# EAGLE design lf (EAGLE 7.7.0)
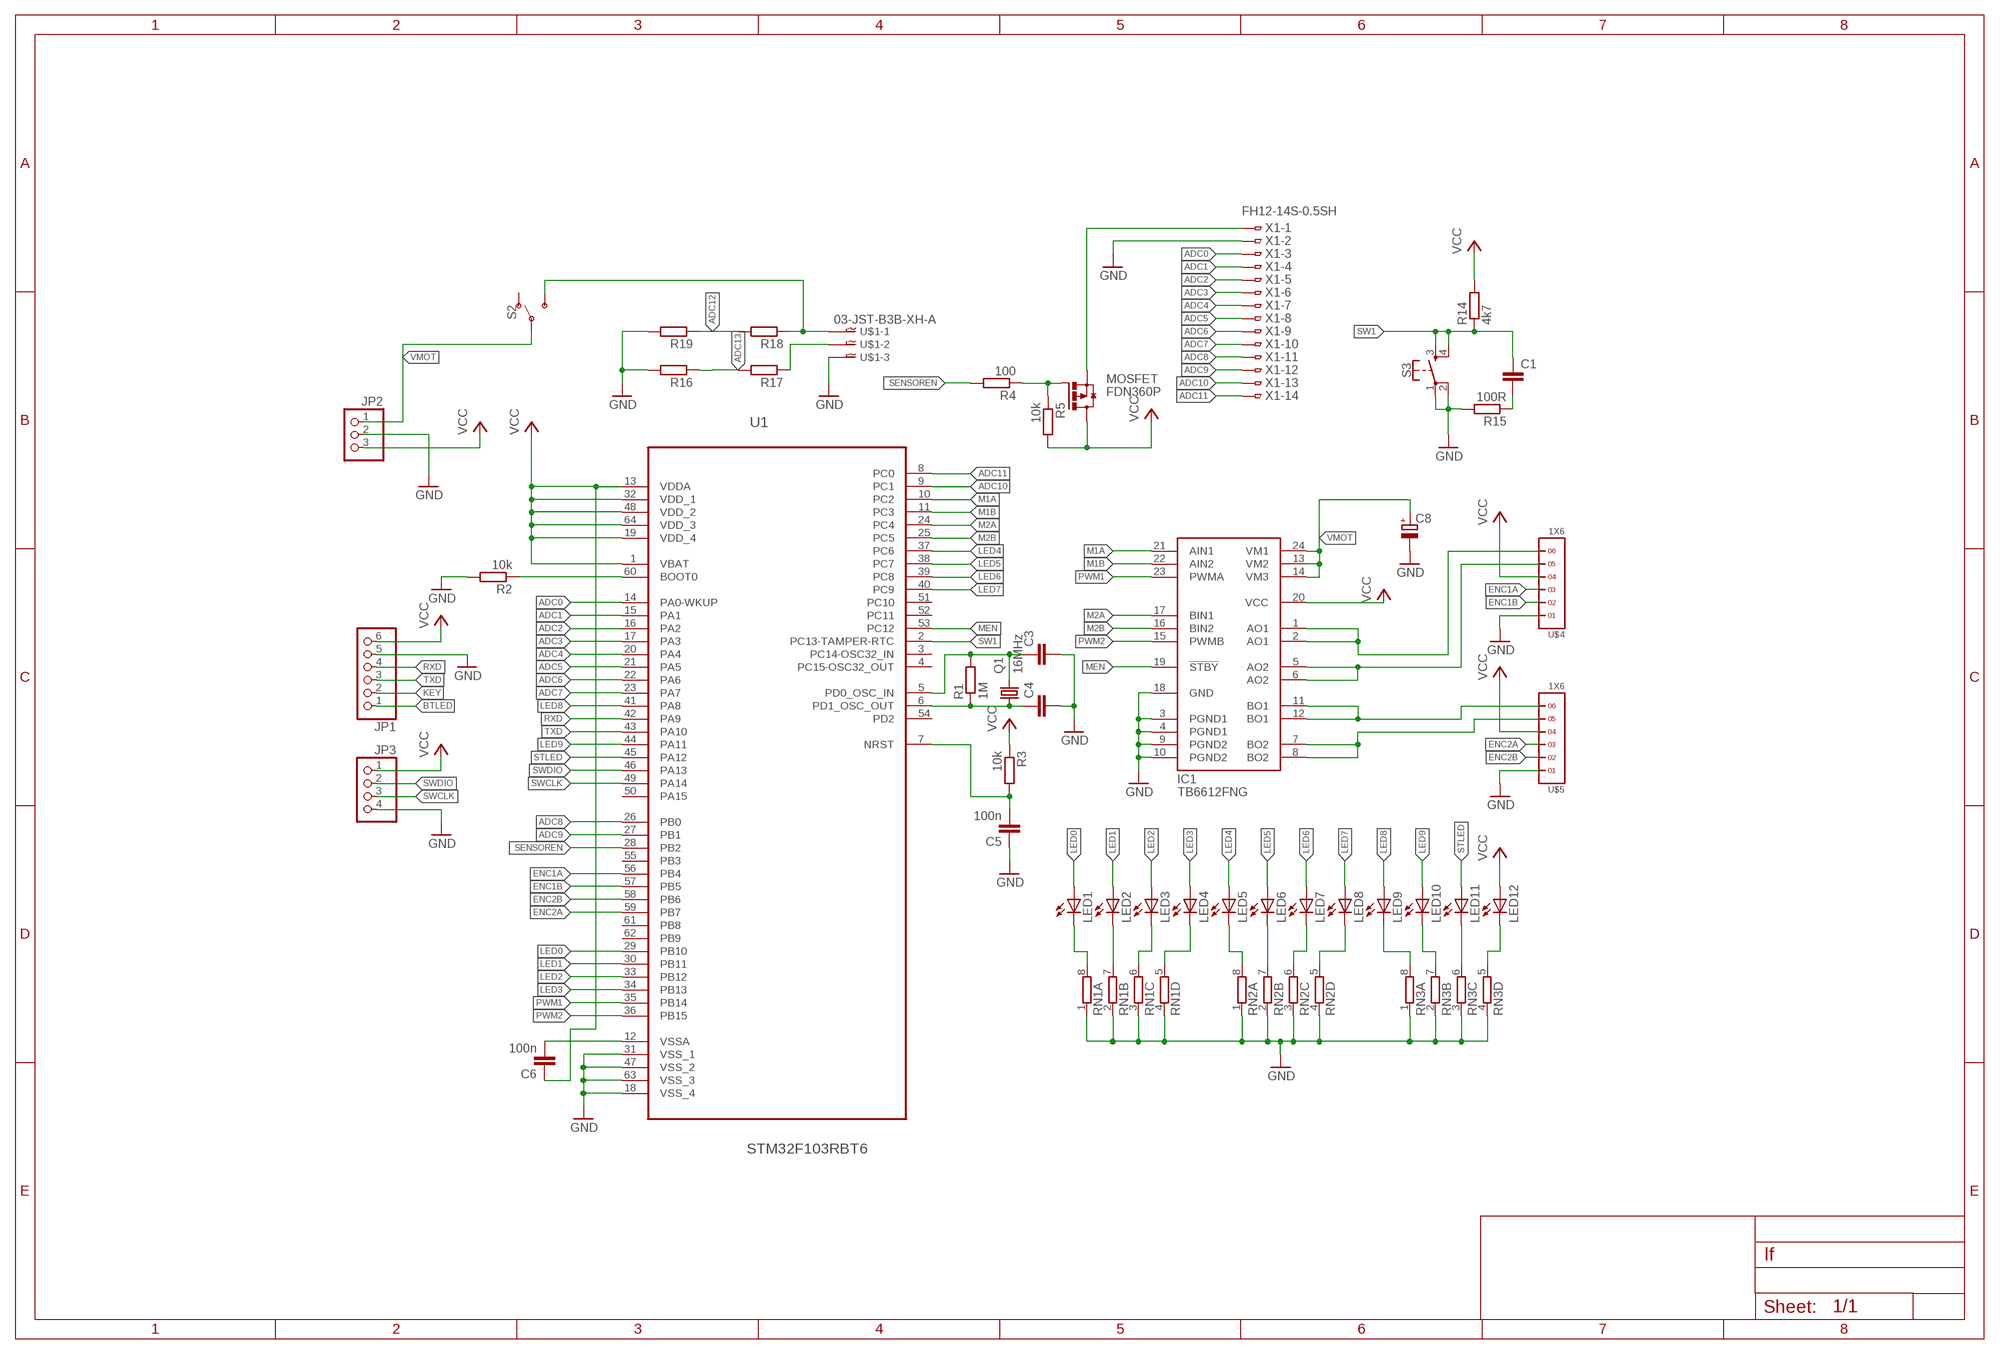
[diagram p0: schematic, sheet 1]

## Parts
C1  C-EUC0603K  [C0603K]
C3  C-EUC0603K  [C0603K]
C4  C-EUC0603K  [C0603K]
C5  100n  C-EUC0603K  [C0603K]
C6  100n  C-EUC0603K  [C0603K]
C8  CPOL-EUC/6032-28R  [C/6032-28R]
IC1  TB6612FNG  [SSOP24]
JP1  PINHD-1X6  [1X06]
JP2  PINHD-1X3  [1X03]
JP3  PINHD-1X4  [1X04]
LED1  LEDCHIPLED_0603  [CHIPLED_0603]
LED2  LEDCHIPLED_0603  [CHIPLED_0603]
LED3  LEDCHIPLED_0603  [CHIPLED_0603]
LED4  LEDCHIPLED_0603  [CHIPLED_0603]
LED5  LEDCHIPLED_0603  [CHIPLED_0603]
LED6  LEDCHIPLED_0603  [CHIPLED_0603]
LED7  LEDCHIPLED_0603  [CHIPLED_0603]
LED8  LEDCHIPLED_0603  [CHIPLED_0603]
LED9  LEDCHIPLED_0603  [CHIPLED_0603]
LED10  LEDCHIPLED_0603  [CHIPLED_0603]
LED11  LEDCHIPLED_0603  [CHIPLED_0603]
LED12  LEDCHIPLED_0603  [CHIPLED_0603]
MOSFET  FDN360P  [SUPER-SOT3]
Q1  16MHz  KX-7  [3.2X2.5_KX-7]
R1  1M  R-EU_R0603  [R0603]
R2  10k  R-EU_R0603  [R0603]
R3  10k  R-EU_R0603  [R0603]
R4  100  R-EU_R0603  [R0603]
R5  10k  R-EU_R0603  [R0603]
R14  4k7  R-EU_R0603  [R0603]
R15  100R  R-EU_R0603  [R0603]
R16  R-EU_R0603  [R0603]
R17  R-EU_R0603  [R0603]
R18  R-EU_R0603  [R0603]
R19  R-EU_R0603  [R0603]
RN1  4R-NEXB28V  [EXB28V]
RN2  4R-NEXB28V  [EXB28V]
RN3  4R-NEXB28V  [EXB28V]
S2  SWITCH-SPDT-PTH-11.6X4.0MM  [SWITCH_SPDT_PTH_11.6X4.0MM]
S3  MOMENTARY-SWITCH-SPST-2-SMD-5.2MM  [TACTILE_SWITCH_SMD_5.2MM]
U1  STM32F103RBT6  [QFP50P1200X1200X160-64N]
U$1  03-JST-B3B-XH-A  [B3B-XH]
U$4  1X6  [1X6]
U$5  1X6  [1X6]
X1  FH12-14S-0.5SH  [FH12-14S-0.5SH]

## Nets
ADC0: U1.14(PA0-WKUP) X1.3
ADC1: U1.15(PA1) X1.4
ADC2: U1.16(PA2) X1.5
ADC3: U1.17(PA3) X1.6
ADC4: U1.20(PA4) X1.7
ADC5: U1.21(PA5) X1.8
ADC6: U1.22(PA6) X1.9
ADC7: U1.23(PA7) X1.10
ADC8: U1.26(PB0) X1.11
ADC9: U1.27(PB1) X1.12
ADC10: U1.9(PC1) X1.13
ADC11: U1.8(PC0) X1.14
ADC12: R18.2 R19.1
ADC13: R16.1 R17.2
BTLED: JP1.1
ENC1A: U1.56(PB4) U$4.3
ENC1B: U1.57(PB5) U$4.2
ENC2A: U1.59(PB7) U$5.3
ENC2B: U1.58(PB6) U$5.2
GND: C3.2 C4.2 C5.1 C8.- IC1.3(PGND1) IC1.4(PGND1) IC1.9(PGND2) IC1.10(PGND2) IC1.18(GND) JP1.5 JP2.2 JP3.4 R2.2 R15.2 R16.2 R19.2 RN1.1 RN1.2 RN1.3 RN1.4 RN2.1 RN2.2 RN2.3 RN2.4 RN3.1 RN3.2 RN3.3 RN3.4 S3.1 S3.2 U1.18(VSS_4) U1.31(VSS_1) U1.47(VSS_2) U1.63(VSS_3) U$1.P$3 U$4.1 U$5.1 X1.2
KEY: JP1.2
LED0: LED1.A U1.29(PB10)
LED1: LED2.A U1.30(PB11)
LED2: LED3.A U1.33(PB12)
LED3: LED4.A U1.34(PB13)
LED4: LED5.A U1.37(PC6)
LED5: LED6.A U1.38(PC7)
LED6: LED7.A U1.39(PC8)
LED7: LED8.A U1.40(PC9)
LED8: LED9.A U1.41(PA8)
LED9: LED10.A U1.44(PA11)
M1A: IC1.21(AIN1) U1.10(PC2)
M1B: IC1.22(AIN2) U1.11(PC3)
M2A: IC1.17(BIN1) U1.24(PC4)
M2B: IC1.16(BIN2) U1.25(PC5)
MEN: IC1.19(!STBY) U1.53(PC12)
N$1: C4.1 Q1.1 R1.1 U1.6(PD1_OSC_OUT)
N$3: R2.1 U1.60(BOOT0)
N$4: C6.2 U1.12(VSSA)
N$5: C1.2 R15.1
N$6: IC1.5(AO2) IC1.6(AO2) U$4.5
N$7: IC1.11(BO1) IC1.12(BO1) U$5.6
N$8: IC1.7(BO2) IC1.8(BO2) U$5.5
N$9: IC1.1(AO1) IC1.2(AO1) U$4.6
N$10: C3.1 Q1.3 R1.2 U1.5(PD0_OSC_IN)
N$11: C5.2 R3.2 U1.7(NRST)
N$12: R18.1 S2.3(S) U$1.P$1
N$14: R17.1 U$1.P$2
N$15: LED1.C RN1.8
N$16: LED2.C RN1.7
N$17: LED3.C RN1.6
N$18: LED4.C RN1.5
N$19: LED5.C RN2.8
N$20: LED6.C RN2.7
N$21: LED7.C RN2.6
N$22: LED8.C RN2.5
N$23: LED9.C RN3.8
N$24: LED10.C RN3.7
N$25: LED11.C RN3.6
N$26: LED12.C RN3.5
N$27: MOSFET.1(G) R4.1 R5.1
N$28: MOSFET.2(S) X1.1
PWM1: IC1.23(PWMA) U1.35(PB14)
PWM2: IC1.15(PWMB) U1.36(PB15)
RXD: JP1.4 U1.42(PA9)
SENSOREN: R4.2 U1.28(PB2)
STLED: LED11.A U1.45(PA12)
SW1: C1.1 R14.1 S3.3 S3.4 U1.2(PC13-TAMPER-RTC)
SWCLK: JP3.3 U1.49(PA14)
SWDIO: JP3.2 U1.46(PA13)
TXD: JP1.3 U1.43(PA10)
VCC: C6.1 IC1.20(VCC) JP1.6 JP2.3 JP3.1 LED12.A MOSFET.3(D) R3.1 R5.2 R14.2 U1.1(VBAT) U1.13(VDDA) U1.19(VDD_4) U1.32(VDD_1) U1.48(VDD_2) U1.64(VDD_3) U$4.4 U$5.4
VMOT: C8.+ IC1.13(VM2) IC1.14(VM3) IC1.24(VM1) JP2.1 S2.2(P)
Unconnected: S2.1(O) U1.3(PC14-OSC32_IN) U1.4(PC15-OSC32_OUT) U1.50(PA15) U1.51(PC10) U1.52(PC11) U1.54(PD2) U1.55(PB3) U1.61(PB8) U1.62(PB9)

## Library data of the parts
C1 C3-C6 = rcl:C-EU: CAPACITOR, European symbol
C8 = rcl:CPOL-EU: POLARIZED CAPACITOR, European symbol
IC1 = tb6612:TB6612FNG
JP1 = pinhead:PINHD-1X6: PIN HEADER
JP2 = pinhead:PINHD-1X3: PIN HEADER
JP3 = pinhead:PINHD-1X4: PIN HEADER
LED1-LED12 = led:LED: LED OSRAM: - CHIPLED LG R971, LG N971, LY N971, LG Q971, LY Q971, LO R971, LY R971 LH N974, LH R974 LS Q976, LO Q976, LY Q976 LO Q996 - Hyper CHIPLED LW Q18S LB Q993, LB Q99A, LB R99A - SideLED LS A670, LO A670, LY A670, LG A670, LP A670 LB A673, LV A673, LT A673, LW A673 LH A674 LY A675 LS A676, LA A676, LO A676, LY A676, LW A676 LS A679, LY A679, LG A679 - Hyper Micro SIDELED® LS Y876, LA Y876, LO Y876, LY Y876 LT Y87S - SmartLED LW L88C, LW L88S LB L89C, LB L89S, LG L890 LS L89K, LO L89K, LY L89K LS L896, LA L896, LO L896, LY L896 - TOPLED LS T670, LO T670, LY T670, LG T670, LP T670 LSG T670, LSP T670, LSY T670, LOP T670, LYG T670 LG T671, LOG T671, LSG T671 LB T673, LV T673, LT T673, LW T673 LH T674 LS T676, LA T676, LO T676, LY T676, LB T676, LH T676, LSB T676, LW T676 LB T67C, LV T67C, LT T67C, LS T67K, LO T67K, LY T67K, LW E67C LS E67B, LA E67B, LO E67B, LY E67B, LB E67C, LV E67C, LT E67C LW T67C LS T679, LY T679, LG T679 LS T770, LO T770, LY T770, LG T770, LP T770 LB T773, LV T773, LT T773, LW T773 LH T774 LS E675, LA E675, LY E675, LS T675 LS T776, LA T776, LO T776, LY T776, LB T776 LHGB T686 LT T68C, LB T68C - Hyper Mini TOPLED® LB M676 - Mini TOPLED Santana® LG M470 LS M47K, LO M47K, LY M47K Source: http://www.osram.convergy.de LUXEON: - LUMILED® LXK2-PW12-R00, LXK2-PW12-S00, LXK2-PW14-U00, LXK2-PW14-V00 LXK2-PM12-R00, LXK2-PM12-S00, LXK2-PM14-U00 LXK2-PE12-Q00, LXK2-PE12-R00, LXK2-PE12-S00, LXK2-PE14-T00, LXK2-PE14-U00 LXK2-PB12-K00, LXK2-PB12-L00, LXK2-PB12-M00, LXK2-PB14-N00, LXK2-PB14-P00, LXK2-PB14-Q00 LXK2-PR12-L00, LXK2-PR12-M00, LXK2-PR14-Q00, LXK2-PR14-R00 LXK2-PD12-Q00, LXK2-PD12-R00, LXK2-PD12-S00 LXK2-PH12-R00, LXK2-PH12-S00 LXK2-PL12-P00, LXK2-PL12-Q00, LXK2-PL12-R00 Source: www.luxeon.com KINGBRIGHT: KA-3528ASYC Source: www.kingbright.com
MOSFET = transistor-power:FDN360P: Single P-Channel, PowerTrench (R) MOSFET Source: http://www.fairchildsemi.com/ds/FD/FDN360P.pdf
Q1 = crystal-geyer_V1_0:KX: Quartz Crystals (MHz) SMD: KX - Serie Model Size l/w/h [mm] Frequency Range Frequency Stability Temp. Range [°C] Load Capacitance AECQ 200 availabel Datasheet KX-4 KX-5 KX-6 KX-7 KX-9A KX-9B KX-12A KX-12B KX-13 KX-20 KX-K KX-KS 1.6/1.2/0.3 2.0/1.6/0.45 2.5/2.0/0.55 3.2/2.5/0.8 5.0/3.2/1.0 5.0/3.2/1.1 6.0/3.5/1.1 6.0/3.5/1.0 7.0/5.0 /1.3 11.6/5.5/1.6 12.3/4.5/4.2 12.3/4.5/3.2 24.0 ~ 80.0 MHz 16.0 ~ 80.0 MHz 12.0 ~ 80.0 MHz 8.0 ~ 60.0 MHz 7,68 ~ 300,0 MHz 8,0 ~ 50,0 MHz 8,0 ~ 150,0 MHz 8,0 ~ 50,0 MHz 6,0 ~ 160,0 MHz 3,579 ~ 25,0 MHz 3,579 ~ 70,0 MHz 3,579 ~ 70,0 MHz ±10 … ±50ppm ±10 … ±50ppm ±10 … ±50ppm ±10 … ±50ppm ±10 … ±50ppm ±10 … ±50ppm ±10 … ±50ppm ±10 … ±50ppm ±10 … ±50ppm ±50ppm ±10 … ±50ppm ±10 … ±50ppm (*) -40°C …+85°C (*) -40°C …+125°C (*) -40°C …+125°C (*) -40°C …+125°C (*) -40°C …+105°C (*) -40°C …+105°C (*) -40°C …+125°C (*) -40°C …+105°C (*) -40°C …+105°C (*) -40°C …+105°C (*) -40°C …+85°C (*) -40°C …+85°C 8, 8…16 8, 8…16 10, 8…16 12, 7…20 16, 10…20 16, 10…20 16, 10…20 16, 12…20 16, 12…20 16, 12…20 16, 12…30 16, 12…30 - yes yes yes - - - - - - - - KX-4.pdf <http://www.geyer-electronic.de/uploads/tx_userartikelfrequenz/GEYER-KX-4.pdf> KX-5.pdf <http://www.geyer-electronic.de/uploads/tx_userartikelfrequenz/GEYER-KX-5.pdf> KX-6.pdf <http://www.geyer-electronic.de/uploads/tx_userartikelfrequenz/GEYER-KX-6.pdf> KX-7.pdf <http://www.geyer-electronic.de/uploads/tx_userartikelfrequenz/GEYER-KX-7.pdf> KX-9A.pdf <http://www.geyer-electronic.de/uploads/tx_userartikelfrequenz/GEYER-KX-9A.pdf> KX-9B.pdf <http://www.geyer-electronic.de/uploads/tx_userartikelfrequenz/GEYER-KX-9B.pdf> KX-12A.pdf <http://www.geyer-electronic.de/uploads/tx_userartikelfrequenz/GEYER-KX-12A.pdf> KX-12B.pdf <http://www.geyer-electronic.de/uploads/tx_userartikelfrequenz/GEYER-KX-12B.pdf> KX-13.pdf <http://www.geyer-electronic.de/uploads/tx_userartikelfrequenz/GEYER-KX-13.pdf> KX-20.pdf <http://www.geyer-electronic.de/uploads/tx_userartikelfrequenz/GEYER-KX-20.pdf> KX-K.pdf <http://www.geyer-electronic.de/uploads/tx_userartikelfrequenz/GEYER-KX-K.pdf> KX-KS.pdf <http://www.geyer-electronic.de/uploads/tx_userartikelfrequenz/GEYER-KX-KS.pdf> <http://www.geyer-electronic.de/fileadmin/template/img/logo-geyer-electronic.png> Details see: http://www.geyer-electronic.de/Frequenz-Produkte.9.0.html Created 2016-06-07, Hans Locher 2016 (C) Geyer Quartz Technology KX4,KX5,KX6,KX7,KX9A,KX9B,KX12A,KX12B,KX13,KX20,KXK,KXKS;1612;2016;2520;3225;5032;6035;7050;11655;12345;1,6x1,2;2,0x1,6;2,5x2,0;3,2x2,5;5,0x3,2;6,0x3,5;7,0x5,0;11,6x5,5;12,3x4,5;12,3x4,5;1.6x1.2;2.0x1.6;2.5x2.0;3.2x2.5;5.0x3.2;6.0x3.5;7.0x5.0;11.6x5.5;12.3x4.5;12.3x4.5;
R1-R5 R14-R19 = rcl:R-EU_: RESISTOR, European symbol
RN1-RN3 = resistor-dil:4R-N: Array Chip Resistor Source: RS Component / Phycomp; OC_FARNELL: unknown; OC_NEWARK: unknown
S2 = SparkFun-Switches:SWITCH-SPDT: Single Pole, Double Throw (SPDT) Switch Single-pole, double-throw (SPDT) switch. Variant Overview SMD-AYZ0202 Surface Mount DPDT Switch <https://www.sparkfun.com/products/597> (COM-00597) Used on e.g. LilyPad Arduino USB - ATmega32U4 Board <https://www.sparkfun.com/products/12049> PTH-11.6X4.0MM SPDT Mini Power Switch <https://www.sparkfun.com/products/102> (COM-00102) Used on e.g. SparkFun Simon Says - Through-Hole Soldering Kit <https://www.sparkfun.com/products/10547> (KIT-10547) PTH-11.6X4.0MM-KIT KIT version of SPDT Mini Power Switch - Simplifies soldering by removing tStop of switch pins - only one side can be soldered. PTH-11.6X4.0MM-LOCK LOCK version of SPDT Mini Power Switch - Offset pins hold switch in place for easier soldering. SMD-RIGHT-ANGLE Surface Mount Right Angle Switch <https://www.sparkfun.com/products/10860> (COM-10860) Used on e.g. SparkFun ESP8266 Thing <https://www.sparkfun.com/products/13231>; PROD_ID: SWCH-08261; SF_SKU: COM-00102
S3 = SparkFun-Switches:MOMENTARY-SWITCH-SPST-2: Momentary Switch (Pushbutton) - SPST - Two Circuits Normally-open (NO) SPST momentary switches (buttons, pushbuttons). Schematic symbol includes two switch circuits. Variants SMD-4.6MMX2.8MM - 4.60mm x 2.80mm Tactile Momentary Button Switch - Used on SparkFun SAMD21 Mini Breakout <https://www.sparkfun.com/products/13664> SMD-5.2MM - Mini Pushbutton Switch - SMD <https://www.sparkfun.com/products/8720> - Used on Arduino Pro Mini <https://www.sparkfun.com/products/11114>; PROD_ID: SWCH-08247; SF_SKU: COM-08720
U1 = STM32F103RBT6:STM32F103RBT6: 32BIT MCU; AVAILABILITY: Good; DESCRIPTION: Mainstream Performance line, ARM Cortex-M3 MCU with 128 Kbytes Flash, 72 MHz CPU, motor control, USB and CAN; MF: STMicroelectronics; MP: STM32F103RBT6; PACKAGE: LQFP-64 STMicroelectronics; PRICE: 5.34 USD
U$1 = bt_con-jst-xh:03-JST: JST CONNECTOR
U$4 U$5 = headers(2mm):1X6
X1 = con-hirose:FH12-14S-0.5S: 0.5mm Pitch Connectors For FPC/FFC Source: Data sheet <http://www.hirose.co.jp/cataloge_hp/e58605370.pdf>; MPN: MC34827; OC_FARNELL: 1324544; OC_NEWARK: 41P0493

## Board
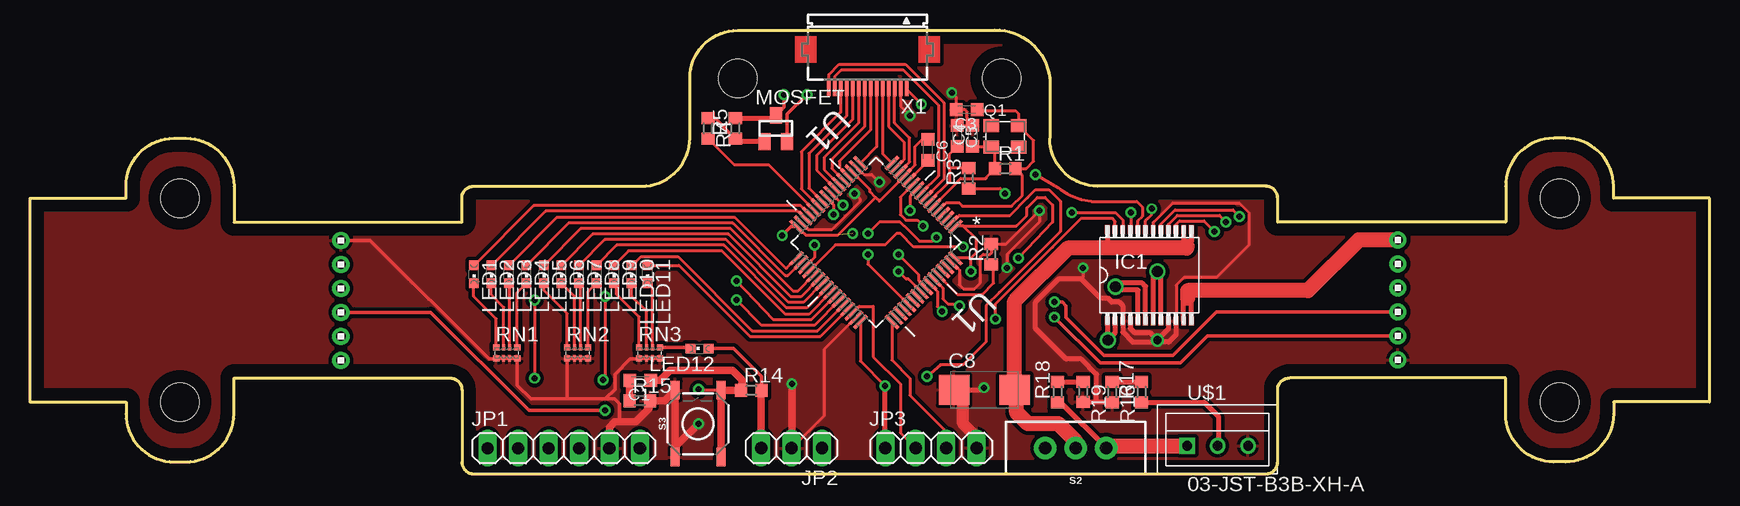
[diagram p1: board, top side]
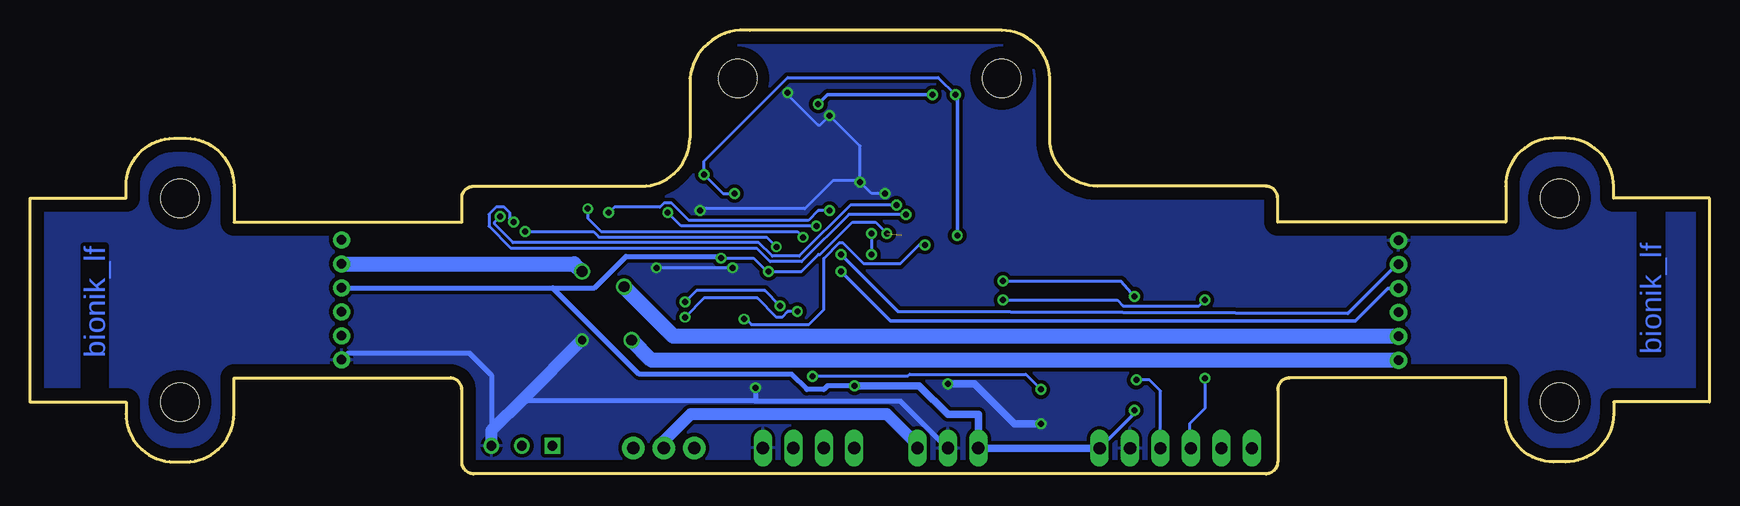
[diagram p2: board, bottom side, seen from below]

Size 140 x 37.03 mm. Coordinates in mm from the lower left corner, seen from the top.
Outline: 0,6 0,23 8,23 8,24 arc-90 12,28 13,28 arc-90 17,24 17,21 36,21 36,23 arc-90 37,24 51,24 arc90 55,28 55,33 arc-90 59,37 80,37 arc-90 85,33 85,28 arc90 89,24 103,24 arc-90 104,23 104,21 123,21 123,24 arc-90 127,28 128,28 arc-90 132,24 132,23 140,23 140,6 132,6 132,5 arc-90 128,1 127,1 arc-90 123,5 123,8 105,8 arc90 104,7 104,1 arc-90 103,0 37,0 arc-90 36,1 36,7 arc90 35,8 17,8 17,5 arc-90 13,1 12,1 arc-90 8,5 8,6 0,6
Copper layers (1*16): Top 0.035mm / dielectric 1.5mm / Bottom 0.035mm
Design rules "default": minimum track width 10mil, minimum drill 24mil, track to track 8mil, track to pad 8mil, pad to pad 8mil, via to via 8mil, smd to smd 8mil, copper to edge 40mil, drill to drill 8mil, minimum pad ring 10mil, minimum via ring 8mil, stop-mask expansion 4mil, vias tented up to drill 0mil, thermal gap 10mil
Holes 3.2 mm at 12.5,23 12.5,6 127.5,6 127.5,23 59,33 81,33

### Footprints (pad centres in the part's own frame; a part is rotated, then mirrored left to right if it is on the bottom)
C0603K = smd 1.05 x 1.08: 1 -0.875,0; 2 0.875,0
C/6032-28R = smd 2.55 x 2.5: + 2.525,0; - -2.525,0
SSOP24 = smd 0.406 x 0.762: 1 -3.651,-3.81; 2 -3.016,-3.81; 3 -2.381,-3.81; 4 -1.746,-3.81; 5 -1.111,-3.81; 6 -0.476,-3.81; 7 0.159,-3.81; 8 0.794,-3.81; 9 1.429,-3.81; 10 2.064,-3.81; 11 2.699,-3.81; 12 3.334,-3.81; 13 3.334,3.81; 14 2.699,3.81; 15 2.064,3.81; 16 1.429,3.81; 17 0.794,3.81; 18 0.159,3.81; 19 -0.476,3.81; 20 -1.111,3.81; 21 -1.746,3.81; 22 -2.381,3.81; 23 -3.016,3.81; 24 -3.651,3.81
1X06 = drill 1.016 long: 1 -6.35,0; 2 -3.81,0; 3 -1.27,0; 4 1.27,0; 5 3.81,0; 6 6.35,0
1X03 = drill 1.016 long: 1 -2.54,0; 2 0,0; 3 2.54,0
1X04 = drill 1.016 long: 1 -3.81,0; 2 -1.27,0; 3 1.27,0; 4 3.81,0
CHIPLED_0603 = smd 0.8 x 0.8: A 0,-0.75; C 0,0.75
SUPER-SOT3 = smd 1 x 1.4: 1 -0.95,-1.1; 2 0.95,-1.1; 3 0,1.1
3.2X2.5_KX-7 = smd 1.3 x 1.1: 1 -1.15,-0.9; 2 1.15,-0.9; 3 1.15,0.9; 4 -1.15,0.9
R0603 = smd 1 x 1.1: 1 -0.85,0; 2 0.85,0
EXB28V = smd 0.525 x 0.5: 1 -0.875,-0.45; 4 0.875,-0.45; 5 0.875,0.45; 8 -0.875,0.45 | smd 0.25 x 0.5: 2 -0.25,-0.45; 3 0.25,-0.45; 6 0.25,0.45; 7 -0.25,0.45
SWITCH_SPDT_PTH_11.6X4.0MM = drill 1.016 pad 1.88: 1 0,2.54; 2 0,0; 3 0,-2.54
TACTILE_SWITCH_SMD_5.2MM = smd 1.524 x 0.762: 1 -2.794,1.905; 2 2.794,1.905; 3 -2.794,-1.905; 4 2.794,-1.905
QFP50P1200X1200X160-64N = smd 1.473 x 0.279: 1 -5.613,3.759; 2 -5.613,3.251; 3 -5.613,2.743; 4 -5.613,2.261; 5 -5.613,1.753; 6 -5.613,1.245; 7 -5.613,0.762; 8 -5.613,0.254; 9 -5.613,-0.254; 10 -5.613,-0.762; 11 -5.613,-1.245; 12 -5.613,-1.753; 13 -5.613,-2.261; 14 -5.613,-2.743; 15 -5.613,-3.251; 16 -5.613,-3.759; 33 5.613,-3.759; 34 5.613,-3.251; 35 5.613,-2.743; 36 5.613,-2.261; 37 5.613,-1.753; 38 5.613,-1.245; 39 5.613,-0.762; 40 5.613,-0.254; 41 5.613,0.254; 42 5.613,0.762; 43 5.613,1.245; 44 5.613,1.753; 45 5.613,2.261; 46 5.613,2.743; 47 5.613,3.251; 48 5.613,3.759 | smd 0.279 x 1.473: 17 -3.759,-5.613; 18 -3.251,-5.613; 19 -2.743,-5.613; 20 -2.261,-5.613; 21 -1.753,-5.613; 22 -1.245,-5.613; 23 -0.762,-5.613; 24 -0.254,-5.613; 25 0.254,-5.613; 26 0.762,-5.613; 27 1.245,-5.613; 28 1.753,-5.613; 29 2.261,-5.613; 30 2.743,-5.613; 31 3.251,-5.613; 32 3.759,-5.613; 49 3.759,5.613; 50 3.251,5.613; 51 2.743,5.613; 52 2.261,5.613; 53 1.753,5.613; 54 1.245,5.613; 55 0.762,5.613; 56 0.254,5.613; 57 -0.254,5.613; 58 -0.762,5.613; 59 -1.245,5.613; 60 -1.753,5.613; 61 -2.261,5.613; 62 -2.743,5.613; 63 -3.251,5.613; 64 -3.759,5.613
B3B-XH = drill 0.8 square: P$1 -2.54,0 | drill 0.8: P$2 0,0; P$3 2.54,0
1X6 = drill 0.8 pad 1.422: 1 -5,0; 2 -3,0; 3 -1,0; 4 1,0; 5 3,0; 6 5,0
FH12-14S-0.5SH = smd 0.3 x 1.3: 1 -3.25,3.25; 2 -2.75,3.25; 3 -2.25,3.25; 4 -1.75,3.25; 5 -1.25,3.25; 6 -0.75,3.25; 7 -0.25,3.25; 8 0.25,3.25; 9 0.75,3.25; 10 1.25,3.25; 11 1.75,3.25; 12 2.25,3.25; 13 2.75,3.25; 14 3.25,3.25

### Placement (x,y rotation side)
C1  50.86,7.79 180 top
C3  78.09,30.38 180 top
C4  78.58,28.19 90 top
C5  77.29,28.19 270 top
C6  74.85,27.01 270 top
C8  79.55,7 0 top
IC1  93.47,16.57 0 top
JP1  44.49,2.14 0 top
JP2  63.49,2.15 180 top
JP3  75.1,2.16 0 top
LED1  37.01,16.65 180 top
LED2  38.47,16.65 180 top
LED3  39.92,16.65 180 top
LED4  41.38,16.65 180 top
LED5  42.84,16.65 180 top
LED6  44.3,16.65 180 top
LED7  45.77,16.65 180 top
LED8  47.23,16.65 180 top
LED9  48.69,16.65 180 top
LED10  50.15,16.65 180 top
LED11  51.48,16.65 180 top
LED12  55.81,10.45 90 top
MOSFET  62.17,28.8 0 top
Q1  81.28,28.15 0 top
R1  81.3,25.47 0 top
R2  80.13,18.32 90 top
R3  78.25,24.66 90 top
R4  56.52,28.82 270 top
R5  58.79,28.82 90 top
R14  60.12,6.97 0 top
R15  50.84,6.1 0 top
R16  90.21,6.83 270 top
R17  92.65,6.84 90 top
R18  85.66,6.83 90 top
R19  87.79,6.84 270 top
RN1  39.74,10.08 0 top
RN2  45.65,10.08 0 top
RN3  51.65,10.08 0 top
S2  87.17,2.16 90 top
S3  55.69,4.19 90 top
U1  70.53,19.3 225 top
U$1  98.99,2.34 0 top
U$4  25.92,14.48 270 top
U$5  114.03,14.52 90 top
X1  69.82,35.4 180 top

### Tracks (layer width: path | path; a pad name or v marks a point on that pad's centre or on a via)
ADC0
  Top 0.254: U1.14 72.56,25.26 73.32,26.03 73.32,28.01 72.07,29.26 X1.3
ADC1
  Top 0.254: X1.4 71.57,28.97 72.87,27.67 72.87,26.23 U1.15
ADC2
  Top 0.254: X1.5 71.07,26.7 U1.16
ADC3
  Top 0.254: X1.6 70.57,27.28 U1.17
ADC4
  Top 0.254: X1.7 70.07,28.68 67.47,26.08 67.47,25.56 U1.20
ADC5
  Top 0.254: X1.8 69.57,28.98 66.83,26.24 66.83,25.48 U1.21
ADC6
  Top 0.254: X1.9 69.07,29.27 66.2,26.4 66.2,25.39 U1.22
ADC7
  Top 0.254: X1.10 68.57,29.57 65.56,26.56 65.56,25.34 U1.23
ADC8
  Top 0.254: X1.11 68.07,29.86 64.93,26.72 64.93,23.82 U1.26
ADC9
  Top 0.254: X1.12 67.57,30.15 64.29,26.88 64.29,23.78 U1.27
ADC10
  Top 0.254: X1.13 67.07,33.15 67.63,33.7 72.78,33.7 75.72,30.77 75.72,26.41 75.72,26.4 75.72,24.85 U1.9
ADC11
  Top 0.254: X1.14 66.59,32.17 66.59,33.31 67.44,34.16 72.97,34.16 76.18,30.95 76.18,24.57 74.7,23.09 U1.8
ADC12
  Top 0.406: R18.2 R19.1
ADC13
  Top 0.406: R16.1 R17.2
ENC1A  (via drill 0.5)
  Top 0.254: U1.56 73.23,16.24 73.03,16.24 v72.39,16.88
  Bottom 0.305: U$4.3 26.8,15.48 29.53,12.75 68.26,12.75 v72.39,16.88
ENC1B  (via drill 0.5)
  Top 0.254: U1.57 74.68,15.53 74.09,16.12 74.09,16.61 v72.39,18.3
  Bottom 0.305: U$4.2 26.07,17.48 30.16,13.38 67.63,13.54 v72.39,18.3
ENC2A  (via drill 0.5)
  Top 0.254: U1.59 75.38,16.19 76.09,15.49 76.09,14.61 76.52,14.18 77.31,14.18 v77.47,14.02
  Top 0.305: U$5.3 98.88,13.52 95.25,9.89 89.53,9.89 86.36,13.06 86.36,14.02 86.04,14.34 v85.41,14.34
  Bottom 0.254: v77.47,14.02 78.74,15.29 84.45,15.29 v85.41,14.34
ENC2B  (via drill 0.5)
  Top 0.254: U1.58 75.04,15.82 75.63,15.22 75.63,13.95 v76.04,13.54
  Top 0.305: U$5.2 98.15,11.52 95.89,9.26 89.22,9.26 v85.41,13.06
  Bottom 0.254: v76.04,13.54 76.83,13.54 77.31,13.06 77.79,13.06 79.38,14.65 83.82,14.65 v85.41,13.06
GND  (via drill 0.5, 0.7)
  Top 0.254: IC1.18 93.62,20.96 95.25,22.59 100.81,22.59 101.59,21.8 101.59,19.09 98.9,16.4 96.2,16.4 95.57,15.76 95.57,15.7 95.56,15.69 95.56,12.79 IC1.10 | U1.63 76.85,17.63 77.44,17.04 77.47,17.04 77.47,15.77 77.81,15.43 78.72,15.43 79.22,15.92 79.22,18.09 79.24,18.09 79.44,18.3 80,18.3 80.17,18.46 80.17,19.13 R2.2 81.35,19.17 v84.14,21.95 84.14,21 81.44,18.3 v81.44,17.19 | U1.18 68.91,25.57 69.5,24.98 70.16,24.98 v70.8,24.34 | U1.47 66.2,10.37 66.2,4.86 JP2.2 | X1.2 72.57,30.66 v73.34,29.89 | C4.2 78.58,29.24 78.11,29.71 78.11,29.89 78.11,30.21 77.95,30.37 77.23,30.37 C3.2 77.21,31.42 v76.83,31.8 | C5.1 C4.2 | C4.2 | v87.79,17.19 87.79,16.4 87.63,16.24 | U1.31 64.28,20.97 64.87,20.38 66.85,20.38 69.22,22.75 69.22,22.91 v68.74,23.38 | RN3.1 RN3.2 RN3.3 RN3.4
  Top 0.305: RN2.4 RN2.3 RN2.2 RN2.1 44.77,6.24 | R16.2 89,5.98 88.9,6.08 | U$4.1 28.35,19.48 38.26,9.57 38.81,9.57 RN1.1 RN1.2 RN1.3 RN1.4 40.62,7.37 41.75,6.24 44.77,6.24 | RN3.1 50.72,9.57 50.01,9.57 48.75,8.32 48.75,7.05 47.94,6.24 | 47.94,6.24 44.77,6.24 | 49.21,4.33 49.13,4.42 49.13,5.85 48.74,6.24 47.94,6.24
  Top 0.406: R19.2 R16.2 | 88.9,6.08 88.9,8.3 87.63,9.57 86.36,9.57 83.82,12.11 83.82,14.34 85.72,16.24 87.63,16.24 89.22,14.65 89.85,14.65 90.17,14.34 90.81,14.34 91.08,14.05 IC1.3 91.08,11.83 91.92,11 93.82,11 v93.98,11.16 | IC1.4 91.72,12.15 92.08,11.79 93.34,11.79 v93.98,11.16 | IC1.10 95.53,11.6 94.93,11 94.14,11 v93.98,11.16 | IC1.9 94.89,12.07 v93.98,11.16 | C8.- 79.34,7 v79.53,7.19
  Top 0.61: JP1.5 48.3,3.9 48.74,4.33 49.21,4.33 50.48,4.33 51.59,5.45 51.59,6.03 R15.2 52.9,6.1 S3.2 S3.1 53.78,2.24 v55.72,4.17 | v63.5,7.51 JP2.2
  Top 1.016: JP3.4 78.91,3.05 77.79,4.17 77.79,6.24 C8.-
  Bottom 0.254: v70.8,24.34 70.8,27.35 v73.34,29.89 74.14,29.1 74.3,29.1 76.83,31.64 v76.83,31.8 | v70.8,24.34 70.96,24.5 73.03,24.5 75.41,22.11 83.98,22.11 v84.14,21.95 | v81.44,17.19 v87.79,17.19 | v68.74,23.38 69.85,23.38 v70.8,24.34
  Bottom 0.406: U$1.P$3 101.53,8.23 103.35,10.05 113.5,10.05 U$5.1 | JP2.2 63.54,2.15 67.47,6.08 79.53,6.08 | 79.53,6.08 98.58,6.08 98.82,6.32 | v79.53,7.19 79.53,6.08
  Bottom 0.61: v55.72,4.17 57.94,4.17 61.28,7.51 v63.5,7.51
  Bottom 1.016: U$1.P$3 101.53,3.61 98.82,6.32 v93.98,11.16
  pour Top (isolate 0.305): -2,-2.25 141,-2.25 141,38.5 -2,38.5
  pour Bottom (isolate 0.305): -2,-2.5 -2,38.5 141,38.5 141,-2.5
LED0
  Top 0.254: U1.29 64.94,21.67 64.24,22.38 41.98,22.38 LED1.A
LED1
  Top 0.254: U1.30 64.57,21.33 63.98,21.92 42.99,21.92 LED2.A
LED2
  Top 0.254: U1.33 63.88,17.97 | LED3.A 43.89,21.36 58.79,21.36 62.98,17.16 63.08,17.16 U1.33 | U1.33 63.9,17.93 63.65,17.68
LED3
  Top 0.254: LED4.A 44.9,20.91 58.6,20.91 62.95,16.56 63.18,16.56 U1.34
LED4
  Top 0.254: U1.37 63.98,15.23 63.63,15.23 58.41,20.45 45.9,20.45 LED5.A
LED5
  Top 0.254: U1.38 65.68,16.2 64.26,14.77 63.44,14.77 58.22,19.99 46.9,19.99 LED6.A
LED6
  Top 0.254: U1.39 64.47,14.32 63.25,14.32 58.03,19.54 47.9,19.54 LED7.A
LED7
  Top 0.254: U1.40 66.38,15.47 64.77,13.86 63.06,13.86 57.84,19.08 48.91,19.08 LED8.A
LED8
  Top 0.254: U1.41 66.74,15.12 64.93,13.31 62.96,13.31 57.67,18.6 49.89,18.6 LED9.A
LED9
  Top 0.254: U1.44 65.64,11.94 60.2,11.94 54,18.13 50.94,18.13 50.21,17.4 LED10.A
M1A  (via drill 0.5)
  Top 0.254: U1.10 73.96,23.75 73.37,23.16 73.37,21.98 v73.34,21.95 | v91.76,21.8 91.76,20.9 IC1.21
  Bottom 0.254: v91.76,21.8 91.28,22.25 87.49,22.25 87.16,22.58 86.51,22.58 85.07,21.14 75.11,21.14 74.3,21.95 v73.34,21.95
M1B  (via drill 0.5)
  Top 0.254: U1.11 73.62,24.13 72.56,23.07 72.56,21.63 73.02,21.17 73.97,21.17 v74.45,20.68 | v86.84,21.8 90.49,21.8 91.12,21.16 91.12,20.9 IC1.22
  Bottom 0.254: v74.45,20.68 85.72,20.68 v86.84,21.8
M2A  (via drill 0.5)
  Top 0.254: IC1.17 94.26,20.82 95.45,22.01 100.28,22.01 v100.81,21.48 | U1.24 66.77,23.45 v67.79,22.43
  Bottom 0.254: v67.79,22.43 71.6,22.43 75.88,18.16 78.11,18.16 79.25,19.29 99.73,19.29 101.28,20.84 101.28,21 v100.81,21.48
M2B  (via drill 0.5)
  Top 0.254: IC1.16 94.89,20.81 95.64,21.55 99.15,21.55 v99.69,21 | U1.25 66.38,23.04 66.97,22.45 66.97,21.66 v66.99,21.64
  Bottom 0.254: v66.99,21.64 71.75,21.64 75.69,17.7 78.3,17.7 79.44,18.84 99.92,18.84 101.74,20.65 101.74,21.65 101.13,22.26 100.48,22.26 100.02,21.8 100.02,21.33 v99.69,21
MEN  (via drill 0.5)
  Top 0.254: IC1.19 92.99,21.11 93.17,21.29 93.17,21.3 93.5,21.64 v93.5,22.11 | v69.85,18.3 69.85,17.5 U1.53 | v75.56,19.73 75.25,19.41 74.14,19.41 72.84,20.71 72.83,20.71 72.54,21 70.8,21 v69.85,20.05
  Bottom 0.254: v93.5,22.11 93.5,21.32 92.39,20.21 76.04,20.21 v75.56,19.73 | v69.85,20.05 v69.85,18.3
N$1
  Top 0.254: U1.6 75.38,22.41 77.37,24.4 77.37,24.44 77.57,24.64 79.67,24.64 79.69,24.65 79.69,24.7 R1.1 80.45,26.92 Q1.1 80.05,27.32 C4.1
N$3
  Top 0.254: U1.60 75.74,16.54 77.31,14.97 79.38,14.97 80.33,15.92 80.33,17.27 R2.1 80.33,17.43
N$4
  Top 0.254: C6.2 74.85,26.1 U1.12
N$5
  Top 0.61: R15.1 49.98,7.95 C1.2
N$6  (via drill 0.9)
  Top 0.406: IC1.6 92.99,15.64 92.71,15.92 90.81,15.92 v90.49,15.61 90.77,15.32 92.36,15.32 IC1.5
  Bottom 1.27: U$4.5 86.36,11.48 v90.49,15.61
N$7
  Top 0.406: IC1.12 96.8,15.01 96.52,15.29 96.17,14.93 IC1.11
  Top 1.27: 96.52,14.65 96.52,15.29 106.52,15.29 110.76,19.52 U$5.6
N$8  (via drill 0.9)
  Top 0.406: IC1.8 94.26,16.59 v93.98,16.88 93.62,16.52 IC1.7
  Bottom 1.27: U$5.5 94.63,17.52 v93.98,16.88
N$9  (via drill 0.9)
  Top 0.406: IC1.1 89.81,11.2 v89.85,11.16 90.45,11.76 IC1.2
  Bottom 1.27: U$4.6 88.17,9.48 v89.85,11.16
N$10
  Top 0.254: U1.5 75.79,22.03 76.38,22.62 77.44,22.62 77.73,22.34 81.82,22.34 82.71,23.23 82.71,24.91 R1.2 | R1.2 82.23,25.39 | R1.2 83.04,25.46 83.66,26.08 83.66,27.81 Q1.3 82.43,30.02 82.16,30.28 82.14,30.26 79.09,30.26 C3.1
N$11
  Top 0.254: U1.7 75.04,22.78 76.64,24.38 76.64,25.45 | 76.64,25.45 76.64,26.66 C5.2 | R3.2 76.7,25.51 76.64,25.45
N$12
  Top 0.406: R18.1 85.89,5.98 S2.3
  Top 1.27: U$1.P$1 89.89,2.34 S2.3
N$14
  Top 0.406: R17.1 97.89,5.99 99.06,4.81 99.06,2.41 U$1.P$2
N$15
  Top 0.254: RN1.8 38.87,12.93 36.99,14.81 36.99,15.88 LED1.C
N$16
  Top 0.254: RN1.7 39.49,13.9 38.42,14.97 38.42,15.85 LED2.C
N$17
  Top 0.254: RN1.6 39.99,15.83 LED3.C
N$18
  Top 0.254: RN1.5 40.62,15.13 LED4.C
N$19
  Top 0.254: RN2.8 44.77,13.38 42.86,15.29 42.86,15.88 LED5.C
N$20
  Top 0.254: RN2.7 45.4,14.8 LED6.C
N$21
  Top 0.254: RN2.6 45.9,15.77 LED7.C
N$22
  Top 0.254: RN2.5 46.52,15.2 LED8.C
N$23
  Top 0.254: RN3.8 50.77,13.09 48.9,14.97 48.9,15.69 LED9.C
N$24
  Top 0.254: RN3.7 51.4,13.58 50.16,14.81 50.16,15.88 LED10.C
N$25
  Top 0.254: RN3.6 51.9,15.48 LED11.C
N$26
  Top 0.305: RN3.5 54.98,10.53 LED12.C
N$27
  Top 0.305: R4.1 57.09,29.67 R5.1
  Top 0.406: MOSFET.1 59.05,27.7 R5.1
N$28  (via drill 0.5)
  Top 0.254: X1.1 73.07,32.07 v74.3,30.84
  Top 0.305: MOSFET.2 63.12,29.99 v64.77,31.64 | v74.3,30.84 74.3,30.93
  Bottom 0.305: v64.77,31.64 73.5,31.64 v74.3,30.84
PWM1  (via drill 0.5)
  Top 0.254: IC1.23 90.45,21.04 90.17,21.32 87.63,21.32 85.23,18.92 | v65.41,19.1 65.41,18.05 U1.35 | 85.23,18.92 | v80.49,12.91 80.49,14.18 85.23,18.92
  Bottom 0.254: v65.41,19.1 65.89,19.1 67.46,17.52 70.5,17.52 72.22,19.25 72.56,19.25 73.82,17.98 73.82,13.7 75.08,12.44 79.86,12.44 80.33,12.91 v80.49,12.91
PWM2  (via drill 0.5)
  Top 0.254: v77.79,18.94 73.66,18.94 72.55,20.05 72.23,20.05 71.28,19.1 67.13,19.1 U1.36 | IC1.15 95.53,20.8 95.83,21.09 97.86,21.09 v98.74,20.21
  Bottom 0.254: v98.74,20.21 93.04,20.21 92.58,19.75 78.6,19.75 v77.79,18.94
RXD  (via drill 0.5)
  Top 0.254: U1.42 67.06,14.79 65.12,12.85 61.97,12.85 v58.9,16.08 | v47.94,14.81 47.94,7.99 v47.78,7.83
  Bottom 0.254: v58.9,16.08 49.05,16.08 v47.94,14.81 | 45.72,3.22 45.72,2.18 JP1.4 45.76,6.91 46.67,7.83 v47.78,7.83
SENSOREN
  Top 0.254: U1.28 61.59,25.77 58.72,25.77 R4.2
STLED
  Top 0.254: U1.45 68.14,13.73 65.88,11.48 60.01,11.48 54.09,17.4 LED11.A
SW1  (via drill 0.5)
  Top 0.254: S3.4 55.77,6.98 v55.72,7.03 | U1.2 76.85,20.97 77.44,21.56 81.69,21.56 83.17,23.04 83.17,23.05 83.82,23.7 84.93,23.7 85.88,22.75 85.88,20.22 84.77,19.11 | 80.8,15.13 | 80.8,15.13 79.7,14.04 79.7,11.01 77.79,9.1 75.88,9.1 v74.77,8.14 | 84.77,19.11 | 84.77,19.11 80.8,15.13
  Top 0.61: S3.3 S3.4 59.26,6.98 R14.1 59.37,7.07 59.37,7.83 58.58,8.62 53.34,8.62 52.51,7.79 C1.1
  Bottom 0.254: v55.72,7.03 56.99,8.3 66.67,8.3 66.84,8.13 v74.76,8.13 v74.77,8.14 74.73,8.14
SWCLK
  Top 0.254: U1.49 71.84,9.49 73.34,7.99 73.34,6.56 76.36,3.54 76.36,2.17 JP3.3
SWDIO
  Top 0.254: 68.5,13.4 U1.46 68.55,13.39 69.14,13.98 70.29,13.98 70.29,9.77 72.55,7.51 72.55,3.44 JP3.2
TXD  (via drill 0.5)
  Top 0.254: U1.43 65.38,12.39 61,12.39 v58.9,14.49 | v42.07,14.49 v42.07,7.99
  Bottom 0.254: v58.9,14.49 49.37,14.49 48.9,14.02 42.55,14.02 v42.07,14.49 | v42.07,7.99 42.07,5.45 43.34,4.17 43.34,2.26 JP1.3
VCC  (via drill 0.5)  (1 unrouted)
  Top 0.254: U1.19 70.01,23.7 70.01,23.54 70.48,23.07 | IC1.20 92.36,21.12 92.71,21.48 92.71,22.27 92.25,22.73 88.47,22.73 88.46,22.74 87.63,22.89 86.76,23.21 86.46,23.38 85.97,23.67 85.73,23.86 v83.82,24.97 | U1.32 63.96,20.61 64.55,20.02 64.58,20.02 64.68,19.92 67.34,19.92 70.48,23.07 | 78.26,17.99 U1.64 | 78.26,17.99 78.42,17.99 78.9,18.46 78.9,19.57 77.79,20.68 | 77.79,20.68 77.23,20.68 U1.1 | C6.1 74.79,27.83 74.3,27.83 73.78,27.31 73.78,25.77 72.9,24.89 U1.13 72.9,24.85 70.8,22.75 70.48,23.07 | U1.48 69.22,9.41 v71.28,7.35 | v78.42,16.88 78.42,17.83 78.26,17.99 | 77.79,20.68 82.22,20.68 83.1,21.57 83.1,22.19 83.98,23.07 84.61,23.07 85.25,22.43 85.25,21 v82.39,17.99 | R3.1 80.86,23.81 v81.28,23.38
  Top 0.305: U1.32 63.43,20.61 v62.71,19.89 | v62.87,31.64 62.87,30.6 MOSFET.3 | LED12.A 58.65,10.45 60.96,8.14 60.96,6.98 R14.2 | U$4.4 33.4,13.48 41.59,5.29 v47.94,5.29
  Top 0.406: R5.2 61.94,29.67 MOSFET.3 | v71.28,7.35 71.28,2.17 JP3.1
  Top 0.61: JP2.3 60.95,6.95 R14.2
  Bottom 0.254: v68.58,20.05 69.53,21 71.44,21 72.74,19.7 72.75,19.7 74.14,18.3 74.28,18.3 75.7,16.88 v78.42,16.88 78.58,16.88 79.69,17.99 v82.39,17.99 | v81.28,23.38 82.23,23.38 v83.82,24.97 83.82,26.08 76.83,33.07 64.29,33.07 v62.87,31.64
  Bottom 0.305: v62.71,19.89 62.71,31.48 v62.87,31.64 | v47.94,5.29 47.94,5.04 JP1.6
  Bottom 0.406: U$5.4 96.44,15.52 | v71.28,7.35 73.5,7.35 73.82,7.03 75.25,7.03 76.52,8.3 89.22,8.3 96.44,15.52 | 96.44,15.52 92.95,15.52 90.33,18.14 82.55,18.14 v82.39,17.99
  Bottom 0.61: JP1.6 JP2.3 60.95,4.97 63.5,4.97 65.88,7.35 v71.28,7.35
VMOT
  Top 0.406: IC1.13 96.8,19.36 96.43,18.83 96.17,19.25 IC1.14 | IC1.24 89.81,19.01 86.5,18.83
  Top 1.27: S2.2 87.17,2.73 85.72,4.17 83.19,4.17 82.23,5.13 82.23,6.85 C8.+ 82.08,14.4 86.5,18.83 96.43,18.83 96.45,19
  Bottom 1.016: JP2.1 66.03,2.42 68.58,4.97 84.93,4.97 87.17,2.73 S2.2

### Text on the board
Bottom: bionik_lf | bionik_lf | bionik_lf